# Altium schematic sheet SAMC21_Xplained_Pro_CAN_LIN.SchDoc: CAN & LIN Interface
size A3; Organization: ATMEL Norway; Address1: Vestre Rosten 79; Address2: N-7075 TILLER; Address3: NORWAY; DocumentNumber: A09-2419; Revision: 5; SheetNumber: 6; SheetTotal: 9; PageSetup: Record=PageOptions|CenterHorizontal=True|CenterVertical=True|PrintScale=1.01|XCorrection=1.00|YCorrection=1.00|PrintKind=1|BorderSize=5000000|LeftOffset=0|BottomOffset=0|Orientation=2|PaperLength=1000|PaperWidth=1000|Scale=100|PaperSource=7|PrintQuality=-4|MediaType=1|DitherType=10|PaperKind=A3 (297 x 420 mm)|PrintScaleMode=1; ProjectName: SAM C21 Xplained Pro
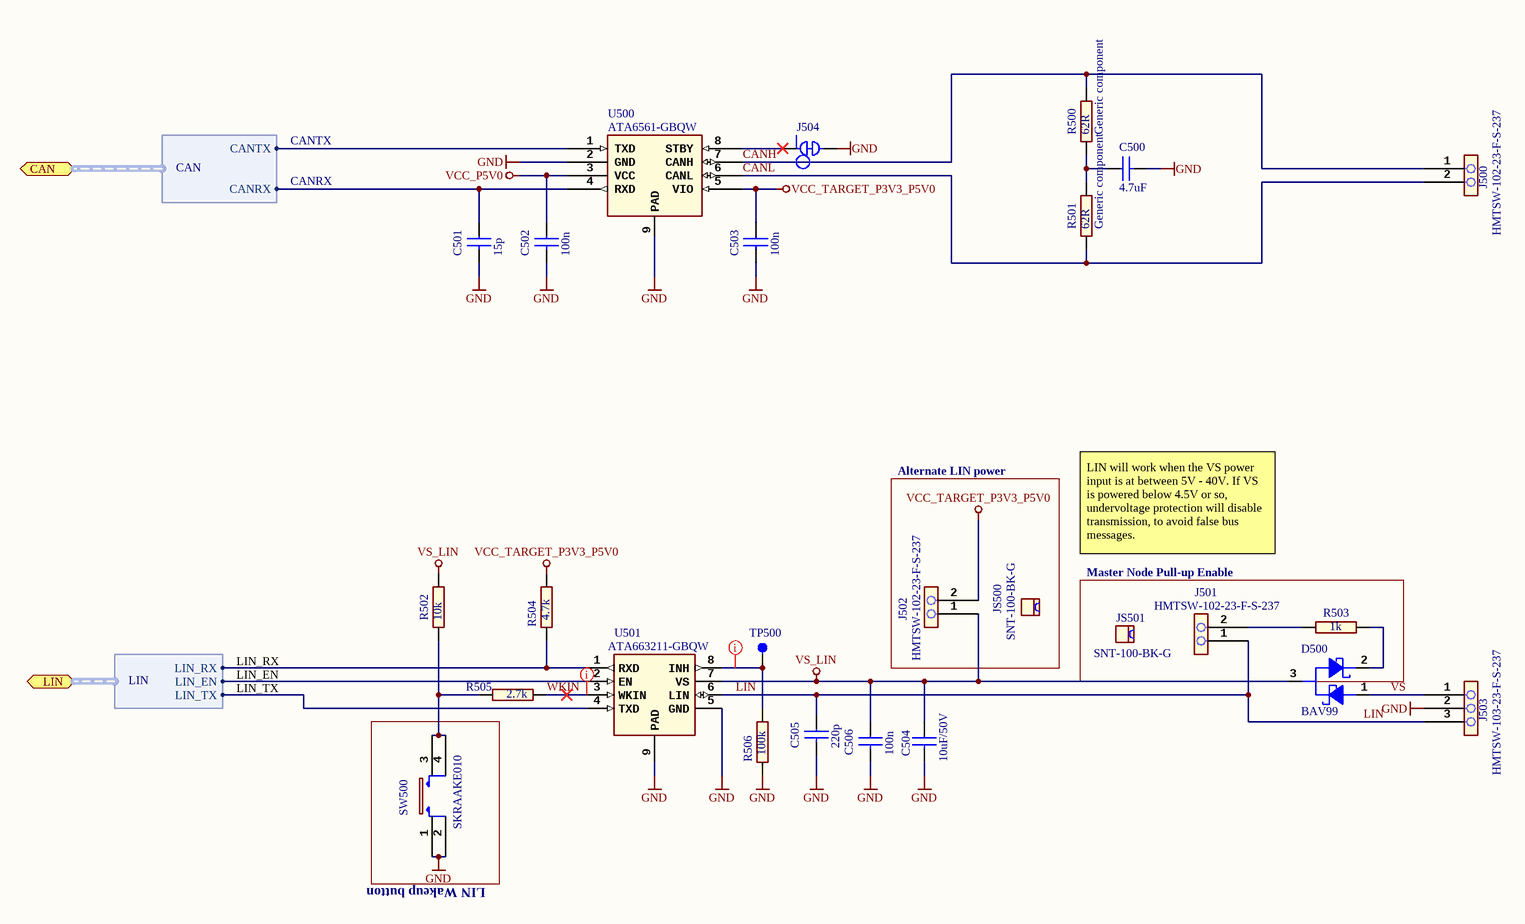
[diagram p0: SAMC21_Xplained_Pro_CAN_LIN.SchDoc]

## Parts
C500  value 4.7uF  [AP1-00003]
C501  value 15p  [AP1-00001]
C502  value 100n  [AP1-00001]
C503  value 100n  [AP1-00001]
C504  value 10uF/50V  [AP1-00015]
C505  value 220p  [AP1-00001]
C506  value 100n  [AP1-00001]
D500  value BAV99  [AP4-00018]
J500  value HMTSW-102-23-F-S-237  [AP8-00733]
J501  value HMTSW-102-23-F-S-237  [AP8-00733]
J502  value HMTSW-102-23-F-S-237  [AP8-00733]
J503  value HMTSW-103-23-F-S-237  [AP8-00745]
J504  (no value)  [AP9-00044]  (net tie, no BOM)
JS500  value SNT-100-BK-G  [AP8-00525]
JS501  value SNT-100-BK-G  [AP8-00525]
R500  Generic component  value 62R  [AP2-00008]
R501  Generic component  value 62R  [AP2-00008]
R502  value 10k  [AP2-00000]
R503  value 1k  [AP2-00000]
R504  value 4.7k  [AP2-00000]
R505  value 2.7k  [AP2-00000]
R506  value 100k  [AP2-00000]
SW500  value SKRAAKE010  [AP8-00137]
TP500  (no value)  [AP8-00010]  (no BOM)
U500  value ATA6561-GBQW  [AP6-00407]
U501  value ATA663211-GBQW  [AP6-00407]

## Blocks framed on the sheet
Alternate LIN power: J502 JS500
Master Node Pull-up Enable: D500 J501 JS501 R503
LIN Wakeup button: SW500

## Ports
CAN (harness CAN), LIN (harness LIN)

## Harnesses
CAN: CANTX, CANRX
LIN: LIN_RX, LIN_EN, LIN_TX

## Nets
GND: C500.2 C501.2 C502.2 C503.2 C504.2 C505.2 C506.2 J503.2 J504.2 R506.1 SW500.1 SW500.2 U500.2(GND) U500.9(PAD) U501.5(GND) U501.9(PAD)
VCC_P5V0: C502.1 U500.3(VCC)
VCC_TARGET_P3V3_P5V0: C503.1 J502.2 R504.2 U500.5(VIO)
VS_LIN: C504.1 C506.1 D500.3(ANODE_CATHODE) J502.1 R502.2 U501.7(VS)
CANH: J500.1 R500.2 U500.7(CANH)
CANL: J500.2 R501.1 U500.6(CANL)
LIN: C505.1 J501.1 J503.3 U501.6(LIN)
VS: D500.1(ANODE) J503.1
WKIN: R505.2 U501.3(WKIN)
NetC500_1: C500.1 R500.1 R501.2
NetC501_1: C501.1 U500.4(RXD) ; port CAN.CANRX
NetD500_2: D500.2(CATHODE) R503.2
NetJ501_2: J501.2 R503.1
NetJ504_1: J504.1 U500.8(STBY)
NetR502_1: R502.1 R505.1 SW500.3 SW500.4
NetR504_1: R504.1 U501.1(RXD) ; port LIN.LIN_RX
NetR506_2: R506.2 TP500.1 U501.8(INH)
NetU500_1: U500.1(TXD) ; port CAN.CANTX
NetU501_2: U501.2(EN) ; port LIN.LIN_EN
NetU501_4: U501.4(TXD) ; port LIN.LIN_TX

## Layout directives
rule Assembly Testpoint Usage [Testpoint - Not Allowed    Multiple - Not Allowed]: NetR506_2, WKIN

## Notes on the sheet
- CANTX
- CANRX
- LIN will work when the VS power input is at between 5V - 40V. If VS is powered below 4.5V or so, undervoltage protection will disable transmission, to avoid false bus messages.
- LIN_RX
- LIN_TX
- LIN_EN
- Date:
- PAGE:
- of
- TITLE:
- Document number:
- Revision:

## Library data of the parts
C500 = A01-0400: Ceramic capacitor, SMD 0805, X5R, 25V, ±10 %; PartGroup: Capacitors,Ceramic,SMD 0805; Manufacturer: Murata; MPN: GRM21BR61E475KA12L; Tolerance: Â±10%; AN: A01-0400; Height: 1,25
C501 = A01-0017: Ceramic capacitor, SMD 0402, NP0, 50V, +/-5%; PartGroup: Capacitors,Ceramic,SMD 0402; TemperatureRange: -55 - +125 deg C; AN: A01-0017; Tolerance: 50V, +/-5%; Height: 0,550000011920929
C502 C503 C506 = A01-0246: Ceramic capacitor, SMD 0402, X7R, 16V, +/-10%; PartGroup: Capacitors,Ceramic,SMD 0402; Manufacturer: Kemet; MPN: C0402C104K4RACTU; TemperatureRange: -55 - +125 deg C; AN: A01-0246; Tolerance: 16V, +/-10%; Height: 0,5
C504 = A01-0586: Ceramic capacitor, SMD 1210, X7S , 50V, Â±10%; PartGroup: Capacitors,Ceramic,SMD 1210; Manufacturer: tdk; MPN: CGA6P3X7S1H106K250AB; TemperatureRange: -55 - +125 deg C; AN: A01-0586; Tolerance: 50V, Â±10%; Height: 2,5
C505 = A01-0030: Ceramic capacitor, SMD 0402, X7R, 50V, +/-10%; PartGroup: Capacitors,Ceramic,SMD 0402; TemperatureRange: -55 - +125 deg C; AN: A01-0030; Tolerance: 50V, +/-10%; Height: 0,550000011920929
D500 = A04-0011: High-speed Double Diode; PartGroup: Diodes,Schottky; Manufacturer: Philips; AN: A04-0011; Height: 1,10000002384186; MPN: BAV99
J500-J502 = A08-1754: 1x2 pin header, 2.54mm pitch, Pin-in-Paste THM; PartGroup: Mechanical devices,Connectors,Pin headers; Manufacturer: SAMTEC; TemperatureRange: - 55 deg C to + 125 deg C; AN: A08-1754; Height: 6,09999990463257; MPN: HMTSW-102-23-F-S-237
J503 = A08-1799: 1x3 pin header, 2.54mm pitch, Pin-in-Paste THM, 1mm hole; PartGroup: Mechanical devices,Connectors,Pin headers; Manufacturer: SAMTEC; AN: A08-1799; Height: 6,09999990463257; MPN: HMTSW-103-23-F-S-237
J504 = A09-0783: Default closed SMD strap, 0603 size; PartGroup: Mechanical devices,PCB implemented components; Value: SMD-STRAP_0603_CLOSED; AN: A09-0783; Height: 0
JS500 JS501 = A08-0543: Jumper cap for 2.54mm pinheader; PartGroup: Mechanical devices,Mounting accessories,Other; Manufacturer: SAMTEC; AN: A08-0543; MPN: SNT-100-BK-G
R500 R501 = A02-0760: Thick film resistor, SMD 1210, 0.5W, 1%; PartGroup: Resistors,SMD,1210 1%; TemperatureRange: -55°C to +155°C; AN: A02-0760; Tolerance: 1%; Height: 0,699999988079071
R502 = A02-0236: Thick film resistor, SMD 0402, 1/16W, 1%; PartGroup: Resistors,SMD,0402 1%; Manufacturer: vishay; MPN: CRCW040210K0FKED; TemperatureRange: -55 - +125 deg C; AN: A02-0236; Tolerance: 1 %; Height: 0,349999994039536
R503 = A02-0212: Thick film resistor, SMD 0402, 1/16W, 1%; PartGroup: Resistors,SMD,0402 1%; TemperatureRange: -55 - +125 deg C; AN: A02-0212; Tolerance: 1 %; Height: 0,349999994039536
R504 = A02-0228: Thick film resistor, SMD 0402, 1/16W, 1%; PartGroup: Resistors,SMD,0402 1%; TemperatureRange: -55ï¿½ to +125ï¿½C; AN: A02-0228; Tolerance: 1 %; Height: 0,349999994039536
R505 = A02-0222: Thick film resistor, SMD 0402, 1/16W, 1%; PartGroup: Resistors,SMD,0402 1%; TemperatureRange: -55 - +125 deg C; AN: A02-0222; Tolerance: 1 %; Height: 0,349999994039536
R506 = A02-0260: Thick film resistor, SMD 0402, 1/16W, 1%; PartGroup: Resistors,SMD,0402 1%; TemperatureRange: -55ï¿½ to +125ï¿½C; AN: A02-0260; Tolerance: 1 %; Height: 0,349999994039536
SW500 = A08-0790: 6.2x6.2 mm SMD tact switch, same as A08-0091 but less force is needed; PartGroup: Mechanical devices,Switches,SMD; Manufacturer: ALPS; TemperatureRange: -30 - +90 deg C; AN: A08-0790; Height: 5,09999990463257; MPN: SKRAAKE010
TP500 = A08-0004: Single SMD testpad; PartGroup: Mechanical devices,Connectors,Test points; AN: A08-0004; Value: TESTPAD; Height: 0
U500 = A06-1172: 5Mbit/s CAN Trasceiver,VCC = 5V, VIO = 2.8-5V, 3x3 mm VDFN8; PartGroup: Integrated Circuits,Interface ICs,CAN; Manufacturer: ATMEL; AN: A06-1172; Height: 0,899999976158142; MPN: ATA6561-GBQW
U501 = A06-1194: LIN Transceiver; PartGroup: Integrated Circuits,Interface ICs,LIN; Manufacturer: ATMEL; AN: A06-1194; Height: 0,899999976158142; MPN: ATA663211-GBQW